# Altium project estop12.PrjPcb
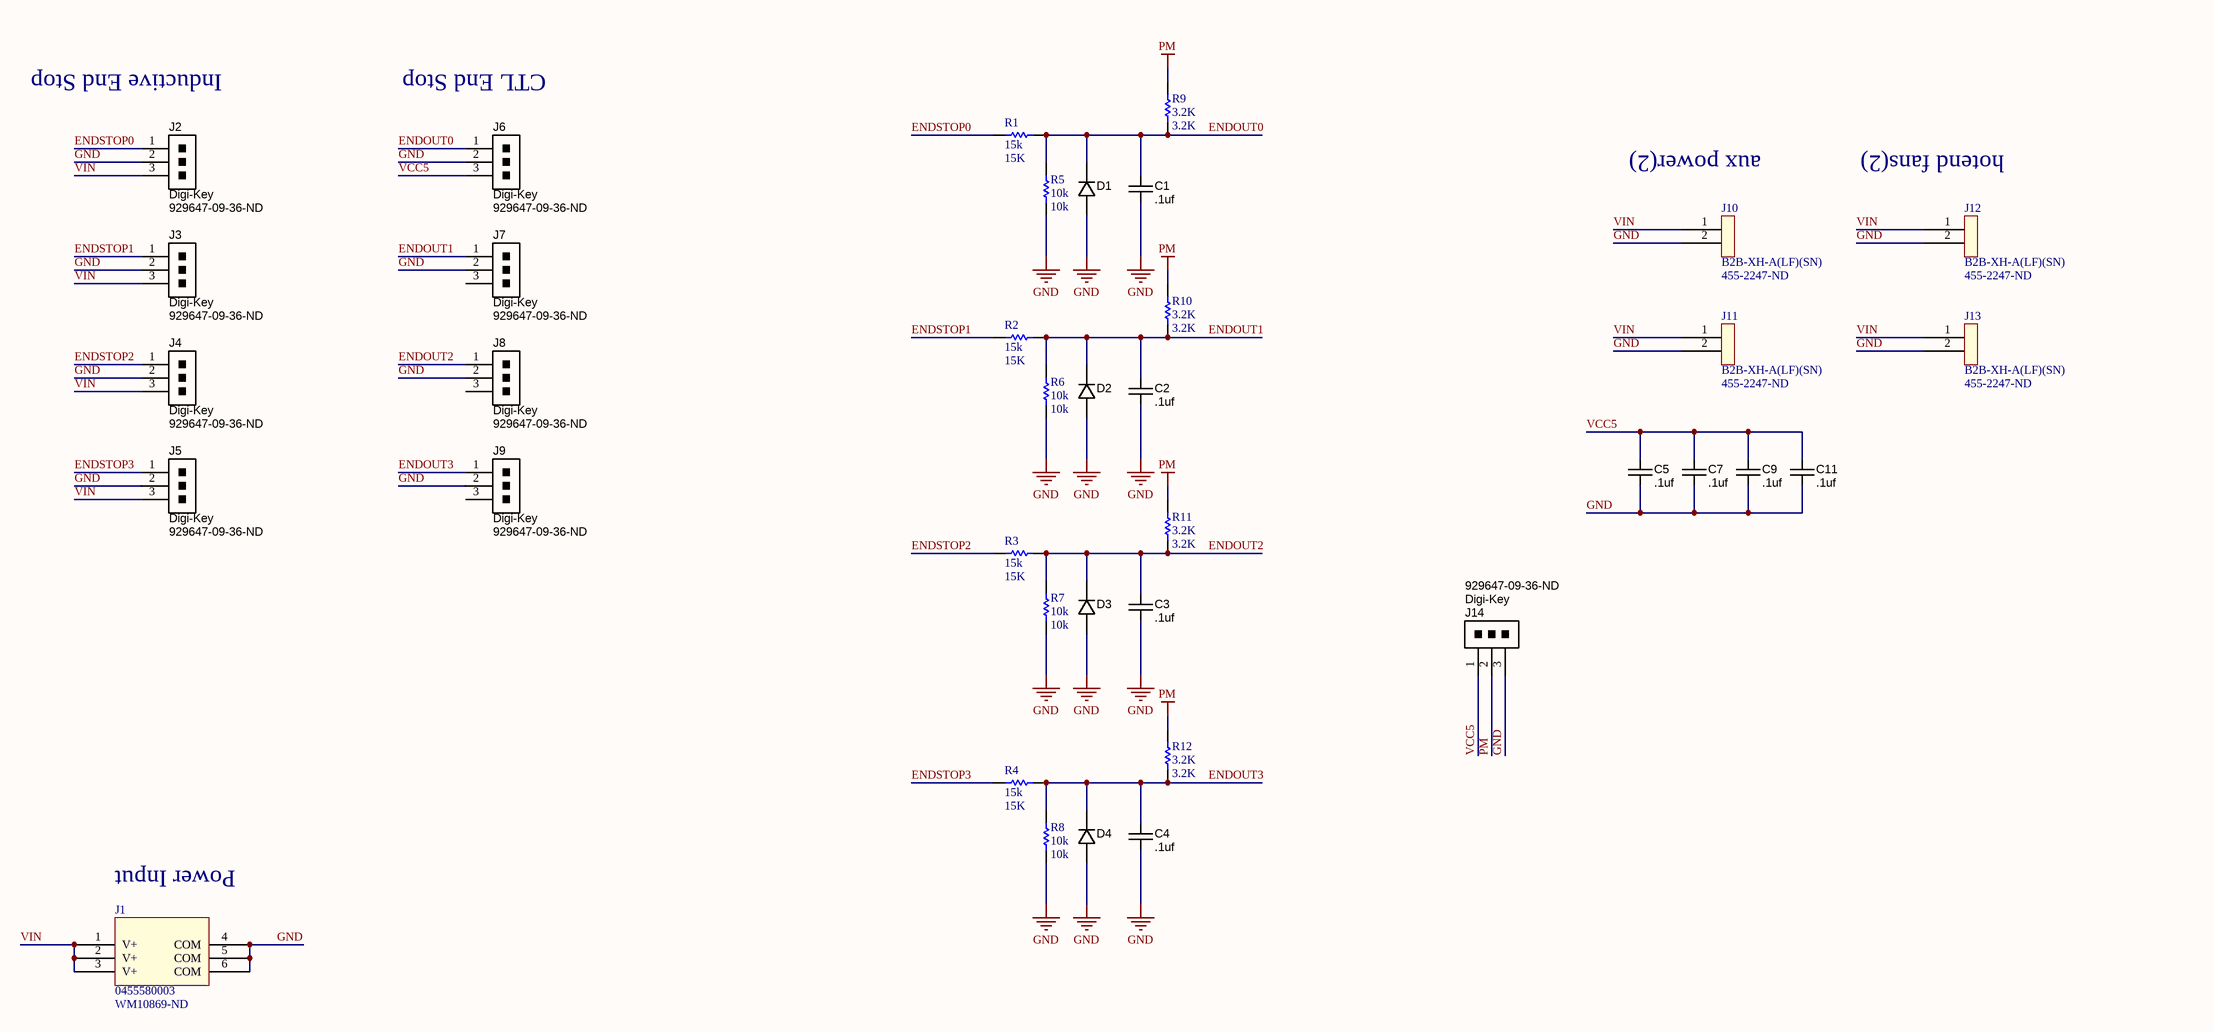
[diagram p0: Sheet1_Etop12.SchDoc]
1 sheet, 38 parts. Net scope: global (net labels, ports and power ports of the same name join across sheets).
Board file: estop12.PcbDoc

## Sheet Sheet1_Etop12.SchDoc
size C

### Parts
C1  value .1uf  [CAPC500P450250X550]  (hidden comment: K104K10X7RF5UH5)
C2  value .1uf  [CAPC500P450250X550]  (hidden comment: K104K10X7RF5UH5)
C3  value .1uf  [CAPC500P450250X550]  (hidden comment: K104K10X7RF5UH5)
C4  value .1uf  [CAPC500P450250X550]  (hidden comment: K104K10X7RF5UH5)
C5  value .1uf  [CAPC500P450250X550]  (hidden comment: K104K10X7RF5UH5)
C7  value .1uf  [CAPC500P450250X550]  (hidden comment: K104K10X7RF5UH5)
C9  value .1uf  [CAPC500P450250X550]  (hidden comment: K104K10X7RF5UH5)
C11  value .1uf  [CAPC500P450250X550]  (hidden comment: K104K10X7RF5UH5)
D1  1N4733ATR  [DO-41]  (value not drawn)
D2  1N4733ATR  [DO-41]  (value not drawn)
D3  1N4733ATR  [DO-41]  (value not drawn)
D4  1N4733ATR  [DO-41]  (value not drawn)
J1  0455580003  Supplier Part Number 1: WM10869-ND  [45558-NP]
J2  Supplier 1: Digi-Key  Supplier Part Number 1: 929647-09-36-ND  [1x3POS_HEADER]  (hidden comment: CONN_HEADER_1x3P_0.100in)
J3  Supplier 1: Digi-Key  Supplier Part Number 1: 929647-09-36-ND  [1x3POS_HEADER]  (hidden comment: CONN_HEADER_1x3P_0.100in)
J4  Supplier 1: Digi-Key  Supplier Part Number 1: 929647-09-36-ND  [1x3POS_HEADER]  (hidden comment: CONN_HEADER_1x3P_0.100in)
J5  Supplier 1: Digi-Key  Supplier Part Number 1: 929647-09-36-ND  [1x3POS_HEADER]  (hidden comment: CONN_HEADER_1x3P_0.100in)
J6  Supplier 1: Digi-Key  Supplier Part Number 1: 929647-09-36-ND  [1x3POS_HEADER]  (hidden comment: CONN_HEADER_1x3P_0.100in)
J7  Supplier 1: Digi-Key  Supplier Part Number 1: 929647-09-36-ND  [1x3POS_HEADER]  (hidden comment: CONN_HEADER_1x3P_0.100in)
J8  Supplier 1: Digi-Key  Supplier Part Number 1: 929647-09-36-ND  [1x3POS_HEADER]  (hidden comment: CONN_HEADER_1x3P_0.100in)
J9  Supplier 1: Digi-Key  Supplier Part Number 1: 929647-09-36-ND  [1x3POS_HEADER]  (hidden comment: CONN_HEADER_1x3P_0.100in)
J10  B2B-XH-A(LF)(SN)  Supplier Part Number 1: 455-2247-ND  [77311-118-02LF]
J11  B2B-XH-A(LF)(SN)  Supplier Part Number 1: 455-2247-ND  [77311-118-02LF]
J12  B2B-XH-A(LF)(SN)  Supplier Part Number 1: 455-2247-ND  [77311-118-02LF]
J13  B2B-XH-A(LF)(SN)  Supplier Part Number 1: 455-2247-ND  [77311-118-02LF]
J14  Supplier 1: Digi-Key  Supplier Part Number 1: 929647-09-36-ND  [1x3POS_HEADER]  (hidden comment: CONN_HEADER_1x3P_0.100in)
R1  15k  [AXIAL-0.3]
R2  15k  [AXIAL-0.3]
R3  15k  [AXIAL-0.3]
R4  15k  [AXIAL-0.3]
R5  10k  [AXIAL-0.3]
R6  10k  [AXIAL-0.3]
R7  10k  [AXIAL-0.3]
R8  10k  [AXIAL-0.3]
R9  3.2K  [AXIAL-0.3]
R10  3.2K  [AXIAL-0.3]
R11  3.2K  [AXIAL-0.3]
R12  3.2K  [AXIAL-0.3]

### Nets
GND: C1.2 C2.2 C3.2 C4.2 C5.2 C7.2 C9.2 C11.2 D1.A D2.A D3.A D4.A J1.4(COM) J1.5(COM) J1.6(COM) J2.2 J3.2 J4.2 J5.2 J6.2 J7.2 J8.2 J9.2 J10.2 J11.2 J12.2 J13.2 J14.3 R5.1 R6.1 R7.1 R8.1
PM: J14.2 R9.2 R10.2 R11.2 R12.2
ENDOUT0: C1.1 D1.K J6.1 R1.2 R5.2 R9.1
ENDOUT1: C2.1 D2.K J7.1 R2.2 R6.2 R10.1
ENDOUT2: C3.1 D3.K J8.1 R3.2 R7.2 R11.1
ENDOUT3: C4.1 D4.K J9.1 R4.2 R8.2 R12.1
ENDSTOP0: J2.1 R1.1
ENDSTOP1: J3.1 R2.1
ENDSTOP2: J4.1 R3.1
ENDSTOP3: J5.1 R4.1
VCC5: C5.1 C7.1 C9.1 C11.1 J6.3 J14.1
VIN: J1.1(V+) J1.2(V+) J1.3(V+) J2.3 J3.3 J4.3 J5.3 J10.1 J11.1 J12.1 J13.1

Not connected (* = marked no-connect by the designer): J7 3; J8 3; J9 3

### Notes on the sheet
- Inductive End Stop
- CTL End Stop
- aux power(2)
- hotend fans(2)
- Power Input

### Library data of the parts
C1-C5 C7 C9 C11 = K104K10X7RF5UH5: 0.10µF ±10% 50V X7R Ceramic Capacitor -55°C ~ 125°C Through Hole Radial 0.142" L x 0.091" W (3.60mm x 2.30mm); Ratings: 50V; X7R; SCDType: source*; Tolerance: ±10%; Operating Temperature: -55°C ~ 125°C; Package / Case: Thru Hole 5mm spacing; Supplier 1: Digi-Key
  C2-C5 C7 C9 C11: Supplier Part Number 1: BC2665TB-ND
D1-D4 = DIODE ZENER 5.1V 1W DO41: Manufacturer 1: Fairchild Semiconductor; Ratings: 5.1V 1W; Diode Type: Standard; SCDType: spec; Package / Case: DO-41; Mounting Type: Through Hole; Manufacturer Part Number 1: 1N4733ATR
J2-J9 J14 = CONN_HEADER_1x3P_0.100in: Pin Header, THT, Single-row, 2.54mm pitch; Manufacturer 1: 3M; Manufacturer Part Number 1: 929647-09-36-I; Pitch: 0.100" (2.54mm); Value: Single-row, 3 positions; QtyOverride: 0.1; SCDType: undef; Category: Connectors; Mounting Type: Through Hole; Terminal Block Type: Header, Male Pins, Single; Package / Case: Pin header; 2.54mm pitch
J10-J13 = B2B-XH-A(LF)(SN): CONN HEADER XH TOP 2POS 2.5MM  JST B2B-XH-A(LF)(SN); Supplier 1: Digi-Key
R1-R12 = Res1: Resistor; Published: 8-Jun-2000; LatestRevisionDate: 17-Jul-2002; LatestRevisionNote: Re-released for DXP Platform.; PackageReference: AXIAL-0.3; Publisher: Altium Limited; PackageDescription: Axial Device, Thru-Hole; 2 Leads; 0.3 in Pin Spacing
  R1-R4: Value: 15K
  R5-R8: Value: 10k
  R9-R12: Value: 3.2K
J1 = 0455580003: Supplier 1: Digi-Key